# EAGLE design LCD_sterowanie (EAGLE 7.7.0)
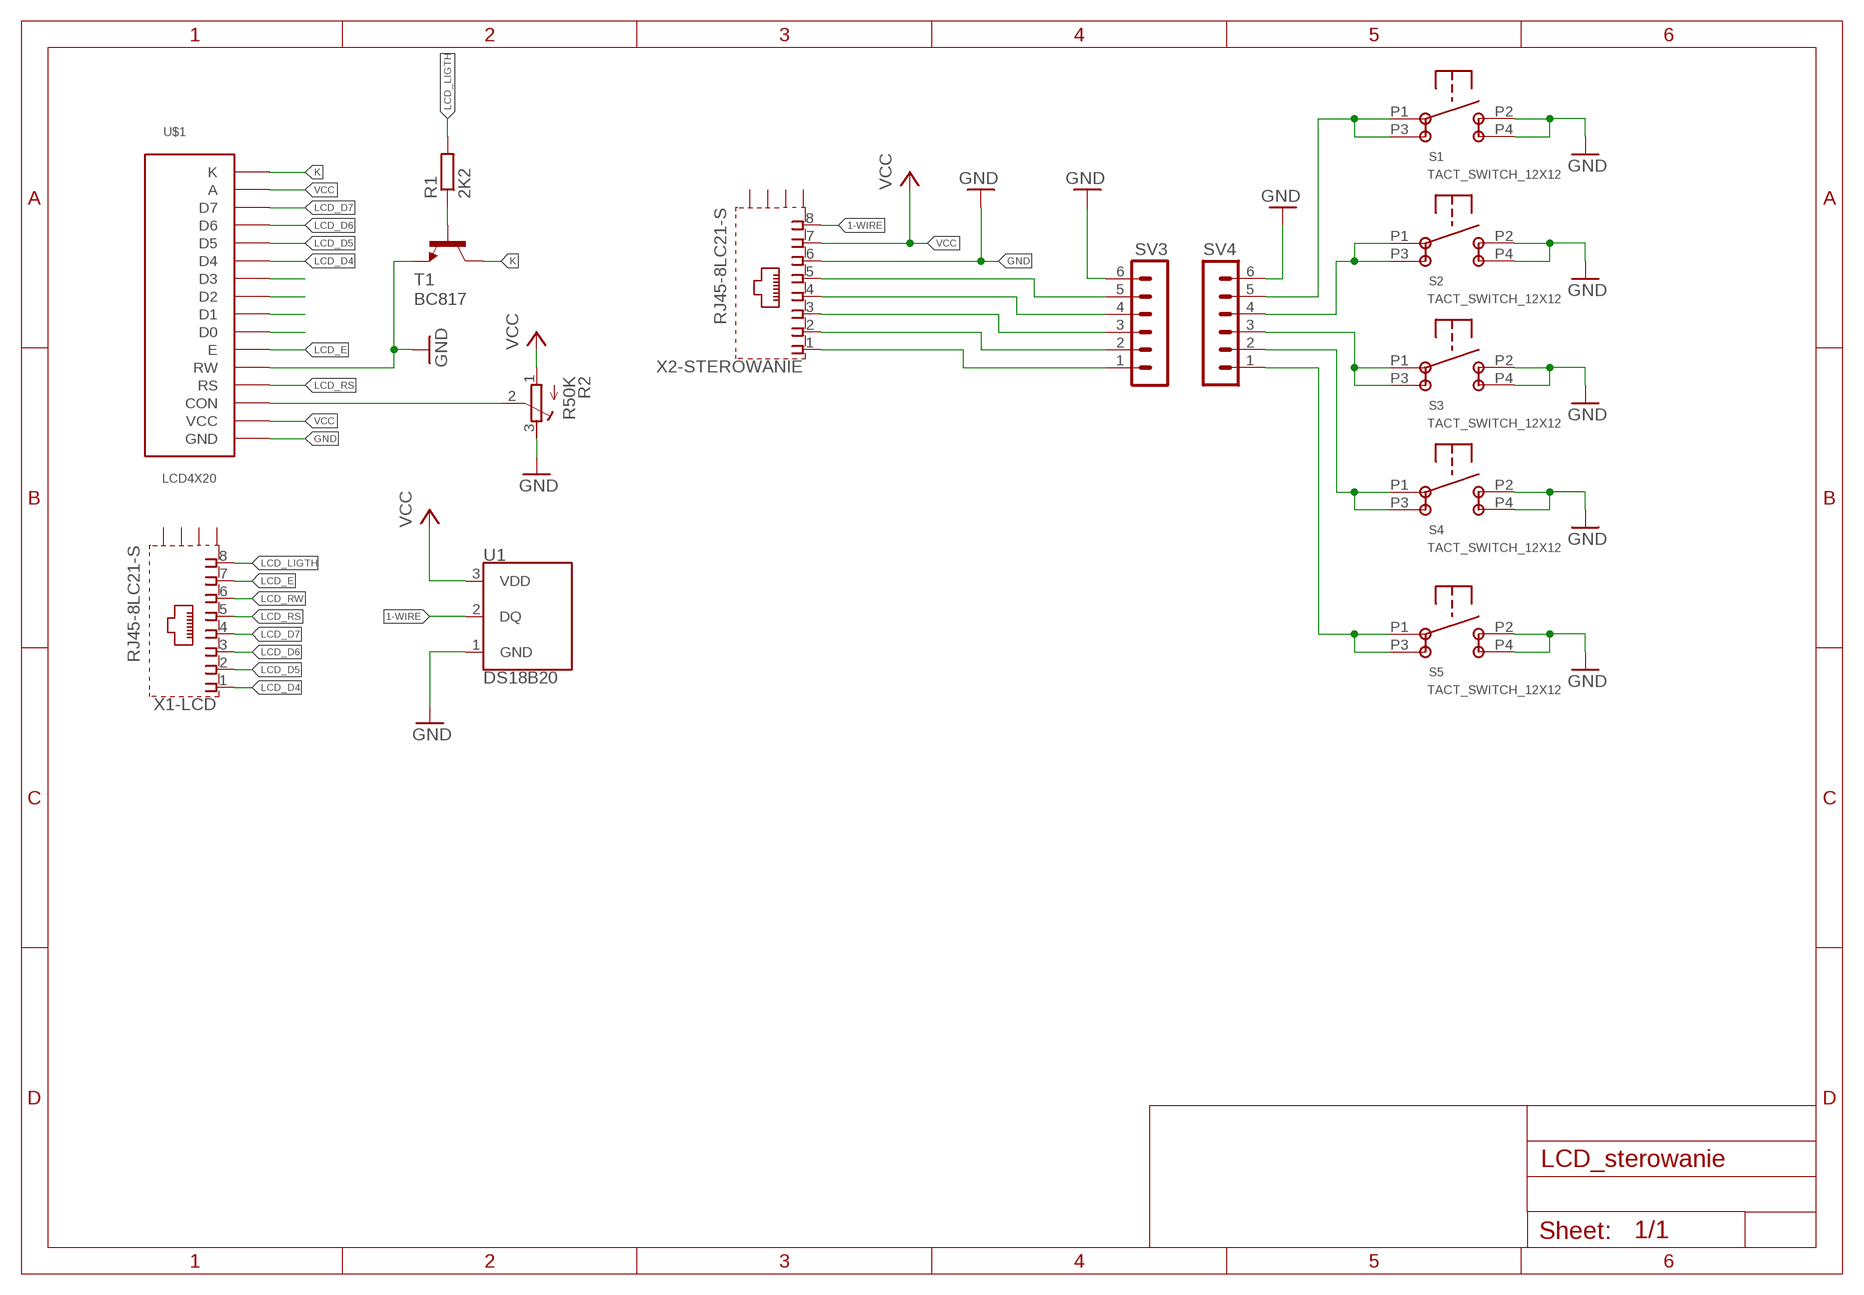
[diagram p0: schematic, sheet 1]

## Parts
R1  2K2  R-EU_M0805  [M0805]
R2  R50K  R-TRIMM3296P  [RTRIM3296P]
S1  TACT_SWITCH_12X12  [TACT_SWITCH_12X12]
S2  TACT_SWITCH_12X12  [TACT_SWITCH_12X12]
S3  TACT_SWITCH_12X12  [TACT_SWITCH_12X12]
S4  TACT_SWITCH_12X12  [TACT_SWITCH_12X12]
S5  TACT_SWITCH_12X12  [TACT_SWITCH_12X12]
SV3  MA06-1  [MA06-1]
SV4  MA06-1  [MA06-1]
T1  BC817  BC847  [SOT23]
U1  DS18B20  [TO-92-AMMO]
U$1  LCD4X20  [LCD4X20]
X1-LCD  RJ45-8LC21-S  [RJ45-SHIELD1]
X2-STEROWANIE  RJ45-8LC21-S  [RJ45-SHIELD1]

## Nets
1-WIRE: U1.2(DQ) X2-STEROWANIE.8
GND: R2.3(E) S1.P2 S1.P4 S2.P2 S2.P4 S3.P2 S3.P4 S4.P2 S4.P4 S5.P2 S5.P4 SV3.6 SV4.6 T1.2(E) U1.1(GND) U$1.GND U$1.RW X2-STEROWANIE.6
K: T1.3(C) U$1.K
LCD_D4: U$1.D4 X1-LCD.1
LCD_D5: U$1.D5 X1-LCD.2
LCD_D6: U$1.D6 X1-LCD.3
LCD_D7: U$1.D7 X1-LCD.4
LCD_E: U$1.E X1-LCD.7
LCD_LIGTH: R1.2 X1-LCD.8
LCD_RS: U$1.RS X1-LCD.5
LCD_RW: X1-LCD.6
N$1: R1.1 T1.1(B)
N$2: S1.P1 S1.P3 SV4.5
N$3: S2.P1 S2.P3 SV4.4
N$4: S3.P1 S3.P3 SV4.3
N$5: S4.P1 S4.P3 SV4.2
N$6: S5.P1 S5.P3 SV4.1
N$7: U$1.D3
N$8: U$1.D2
N$9: U$1.D1
N$10: U$1.D0
N$14: R2.2(S) U$1.CON
S1: SV3.1 X2-STEROWANIE.1
S2: SV3.2 X2-STEROWANIE.2
S3: SV3.3 X2-STEROWANIE.3
S4: SV3.4 X2-STEROWANIE.4
S5: SV3.5 X2-STEROWANIE.5
VCC: R2.1(A) U1.3(VDD) U$1.A U$1.VCC X2-STEROWANIE.7
Unconnected: X1-LCD.S1(S) X1-LCD.S2(S) X1-LCD.S3(S) X1-LCD.S4(S) X2-STEROWANIE.S1(S) X2-STEROWANIE.S2(S) X2-STEROWANIE.S3(S) X2-STEROWANIE.S4(S)

## Library data of the parts
R1 = resistor:R-EU_: RESISTOR, European symbol
R2 = resistor:R-TRIMM: Trimm resistor
S1-S5 = wachcio:TACT_SWITCH_12X12
SV3 SV4 = con-lstb:MA06-1: PIN HEADER; OC_FARNELL: unknown; OC_NEWARK: unknown
T1 = transistor:BC847: NPN TRANSISTOR
U1 = SparkFun-Sensors:DS18B20: Dallas/Maxim DS18B20 1-Wire Temperature Sensor The DS18B20 reports degrees C with 9 to 12-bit precision, -55C to 125C (+/-0.5C). Each sensor has a unique 64-Bit Serial number etched into it - allows for a huge number of sensors to be used on one data bus. Datasheet <http://datasheets.maximintegrated.com/en/ds/DS18B20.pdf> SparkFun Products One Wire Digital Temperature Sensor - DS18B20 <https://www.sparkfun.com/products/245> (SEN-00245); STORE_ID: SEN-00245
U$1 = wachcio:LCD4X20
X1-LCD X2-STEROWANIE = con-tycoelectronics:RJ45*2: RJ45 Low Profile Shield Type 2 For all RJ45 L, LC, LCT and X Series Models Source: www.tycoelectronics.com .. ENG_DS_1654001_1099_RJ_L_0507.pdf; OC_FARNELL: unknown; OC_NEWARK: unknown

## Board
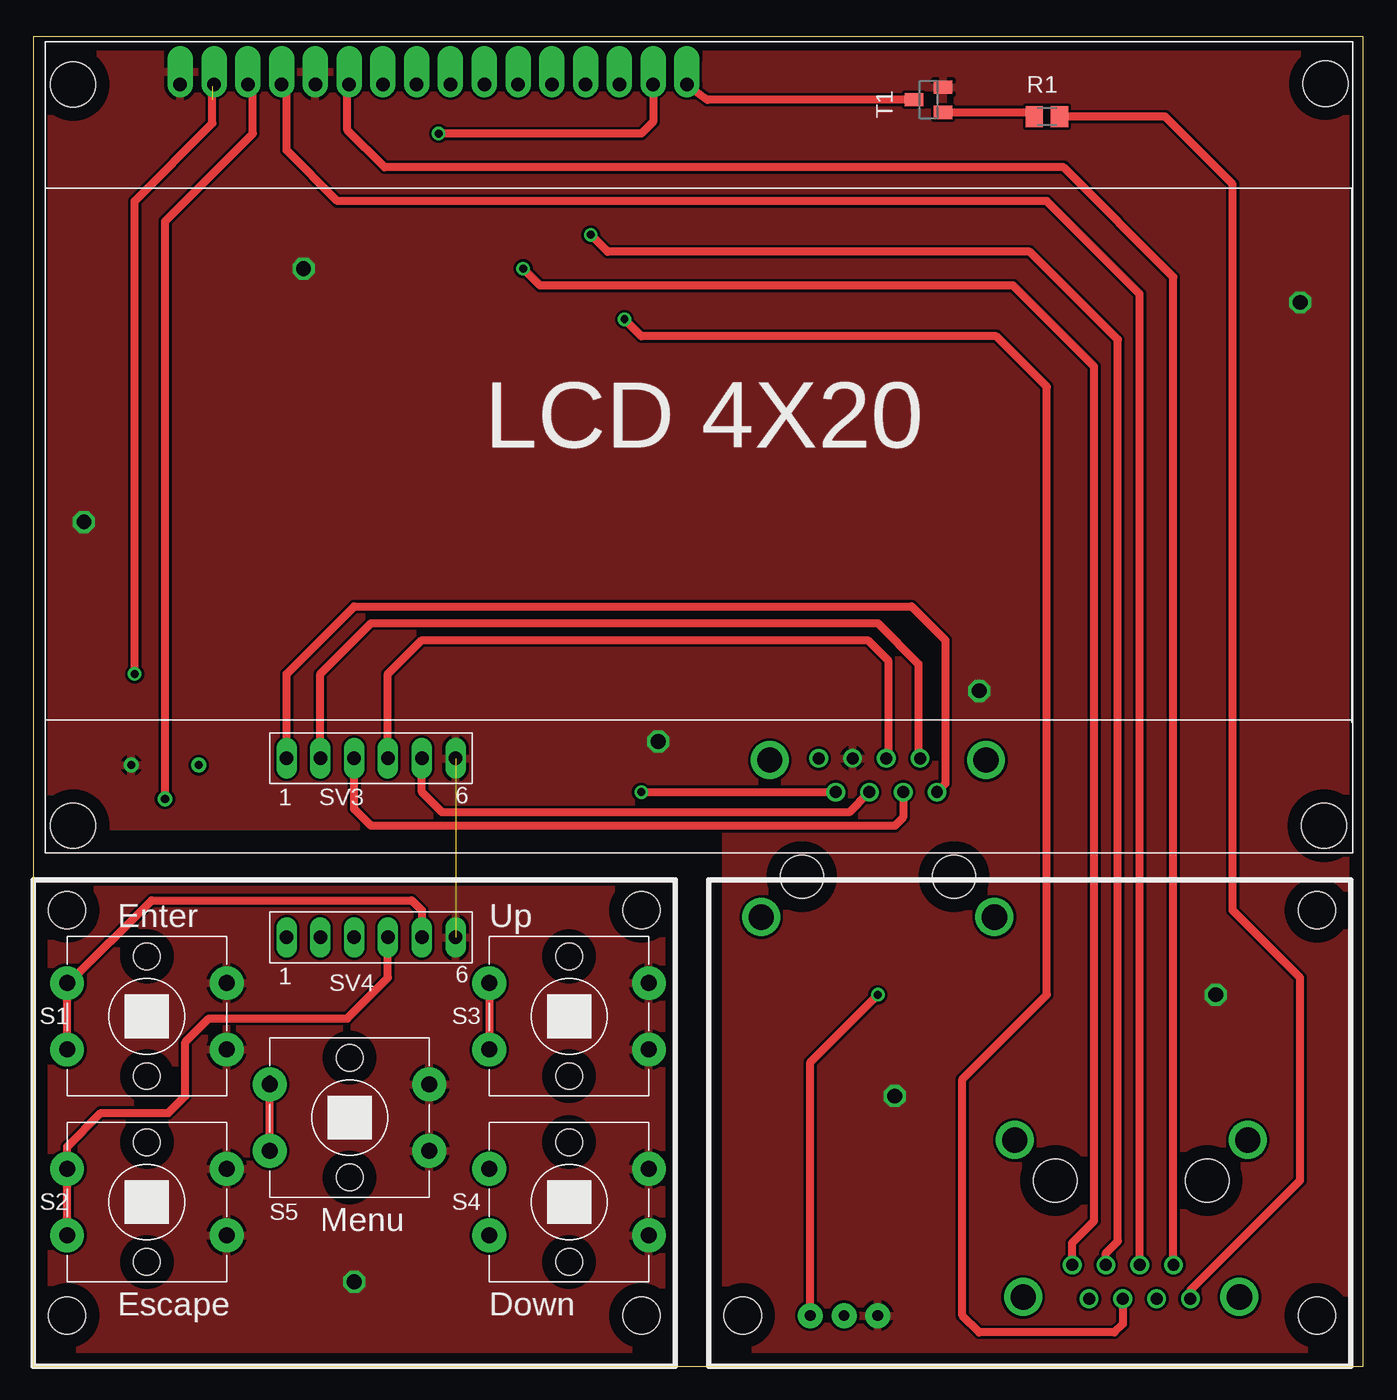
[diagram p1: board, top side]
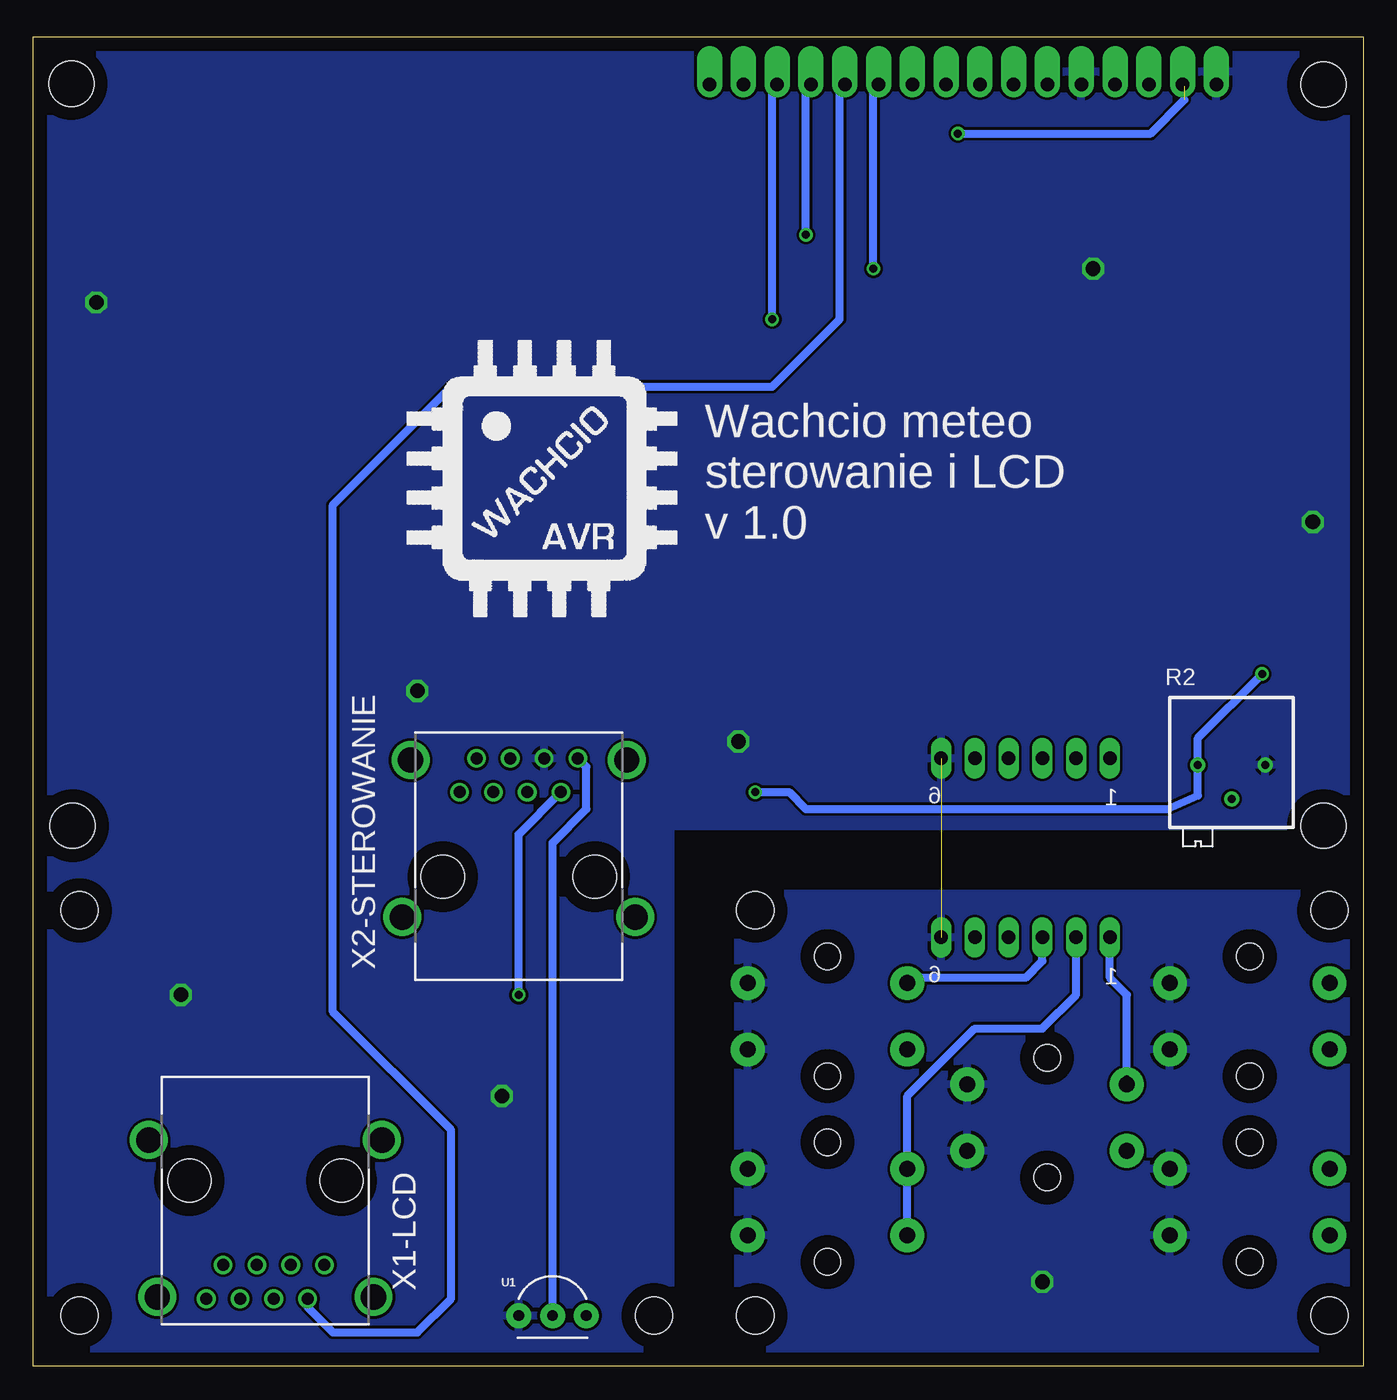
[diagram p2: board, bottom side, seen from below]

Size 100 x 100 mm. Coordinates in mm from the lower left corner, seen from the top.
Outline: 0,0 100,0 100,100 0,100 0,0
Copper layers (1*16): Top 0.035mm / dielectric 1.5mm / Bottom 0.035mm
Design rules "default": minimum track width 10mil, minimum drill 24mil, track to track 8mil, track to pad 8mil, pad to pad 8mil, via to via 8mil, smd to smd 8mil, copper to edge 40mil, drill to drill 8mil, minimum pad ring 10mil, minimum via ring 8mil, stop-mask expansion 4mil, vias tented up to drill 0mil, thermal gap 10mil
Holes 2.8 mm at 2.54,34.29 45.72,34.29 45.72,3.81 2.54,3.81 96.52,34.29 96.52,3.81 53.34,3.81

### Footprints (pad centres in the part's own frame; a part is rotated, then mirrored left to right if it is on the bottom)
M0805 = smd 1.3 x 1.6: 1 -0.95,0; 2 0.95,0
RTRIM3296P = drill 0.61: 1 0,-2.54; 2 2.54,0; 3 0,2.54
TACT_SWITCH_12X12 = drill 1.2 pad 2.54: P1 -6.35,2.15; P2 5.65,2.15; P3 -6.35,-2.85; P4 5.65,-2.85 | hole 2: -0.35,4.15; -0.35,-4.85
MA06-1 = drill 1.016 long: 1 -6.35,0; 2 -3.81,0; 3 -1.27,0; 4 1.27,0; 5 3.81,0; 6 6.35,0
SOT23 = smd 1 x 1.4: 1 -0.95,-1.1; 2 0.95,-1.1; 3 0,1.1
TO-92-AMMO = drill 0.813 pad 1.88: 1 -2.54,0; 2 0,0; 3 2.54,0
LCD4X20 = drill 1.016 pad 1.93 offset: A -1.27,32.385; CON -31.75,32.385; D0 -21.59,32.385; D1 -19.05,32.385; D2 -16.51,32.385; D3 -13.97,32.385; D4 -11.43,32.385; D5 -8.89,32.385; D6 -6.35,32.385; D7 -3.81,32.385; E -24.13,32.385; GND -36.83,32.385; K 1.27,32.385; RS -29.21,32.385; RW -26.67,32.385; VCC -34.29,32.385 | hole 3.4: -44.89,32.4; 49.26,32.45; 49.16,-23.35; -44.89,-23.35
RJ45-SHIELD1 = drill 0.9 pad 1.4: 1 -4.445,6.35; 2 -3.175,8.89; 3 -1.905,6.35; 4 -0.635,8.89; 5 0.635,6.35; 6 1.905,8.89; 7 3.175,6.35; 8 4.445,8.89 | drill 1.9 pad 2.5: S1 -8.763,-3.048; S2 8.763,-3.048; S3 -8.128,8.76; S4 8.128,8.76 | hole 3.251: -5.715,0; 5.715,0

### Placement (x,y rotation side)
R1  76.2,93.98 0 top
R2  9.91,45.21 270 bottom
S1  8.89,26.67 0 top
S2  8.89,12.7 0 top
S3  40.64,26.67 0 top
S4  40.64,12.7 0 top
S5  24.13,19.05 0 top
SV3  25.4,45.72 0 top
SV4  25.4,32.26 0 top
T1  67.31,95.25 90 top
U1  60.96,3.81 0 bottom
U$1  47.88,64.01 0 top
U$2  [LOGO]  59.69,66.04 0 bottom
X1-LCD  82.55,13.97 180 bottom
X2-STEROWANIE  63.5,36.83 0 bottom

### Tracks (layer width: path | path; a pad name or v marks a point on that pad's centre or on a via)
1-WIRE
  Bottom 0.61: U1.2 60.96,39.37 58.42,41.91 58.42,45.09 X2-STEROWANIE.8
GND  (via drill 1.1)  (1 unrouted)
  other vias: 20.32,82.55 3.81,63.5 71.12,50.8 95.25,80.01 88.9,27.94 64.77,20.32 24.13,6.35 46.99,46.99
  pour Bottom: 1.27,99.06 99.06,99.06 99.06,1.27 52.07,1.27 52.07,40.64 1.27,40.64
  pour Top: 1.27,99.06 1.27,40.64 52.07,40.64 52.07,1.27 99.06,1.27 99.06,99.06
  pour Top: 1.27,35.56 1.27,1.27 47.24,1.27 47.24,35.81 1.27,35.81
  pour Bottom: 1.27,35.56 1.27,1.27 46.99,1.27 46.99,35.56
K
  Top 0.61: T1.3 50.67,95.25 U$1.K
LCD_D4  (via drill 0.6)
  Top 0.61: X1-LCD.1 78.11,9.27 79.76,10.92 79.76,75.18 73.66,81.28 38.1,81.28 v36.83,82.55
  Bottom 0.61: v36.83,82.55 36.83,96.01 U$1.D4
LCD_D5
  Bottom 0.61: X1-LCD.2 79.38,4.45 77.47,2.54 71.12,2.54 68.58,5.08 68.58,17.78 77.47,26.67 77.47,64.77 68.58,73.66 44.45,73.66 39.37,78.74 39.37,96.01 U$1.D5
LCD_D6  (via drill 0.6)
  Top 0.61: v41.91,85.09 43.18,83.82 74.93,83.82 81.53,77.22 81.53,9.4 80.64,8.51 X1-LCD.3
  Bottom 0.61: v41.91,85.09 41.91,96.01 U$1.D6
LCD_D7  (via drill 0.6)
  Top 0.61: X1-LCD.4 81.92,3.17 81.28,2.54 71.12,2.54 69.85,3.81 69.85,21.59 76.2,27.94 76.2,73.66 72.39,77.47 45.72,77.47 v44.45,78.74
  Bottom 0.61: v44.45,78.74 44.45,96.01 U$1.D7
LCD_E
  Top 0.61: X1-LCD.7 85.72,81.92 77.47,90.17 26.42,90.17 23.62,92.96 23.62,96.27 U$1.E
LCD_LIGTH
  Top 0.61: X1-LCD.8 87,5.71 95.25,13.97 95.25,29.21 90.17,34.29 90.17,88.9 85.09,93.98 R1.2
LCD_RS
  Top 0.61: X1-LCD.5 83.19,80.64 76.2,87.63 22.86,87.63 19.05,91.44 19.05,96.01 U$1.RS
N$1
  Top 0.61: T1.1 74.93,94.3 R1.1
N$2
  Top 0.61: S1.P3 S1.P1 2.66,28.82 8.89,35.05 28.45,35.05 29.21,34.29 SV4.5
N$3
  Top 0.61: S2.P1 S2.P3 2.54,16.51 5.08,19.05 10.16,19.05 11.43,20.32 11.43,24.38 13.21,26.16 23.62,26.16 26.67,29.21 SV4.4
N$4
  Top 0.61: S3.P1 S3.P3
  Bottom 0.61: S3.P1 33.9,29.21 25.4,29.21 24.13,30.48 SV4.3
N$5
  Bottom 0.61: S4.P3 S4.P1 34.29,20.32 29.21,25.4 24.13,25.4 21.59,27.94 SV4.2
N$6  (via drill 0.6)
  Top 0.61: S5.P3 S5.P1 v17.78,21.59
  Bottom 0.61: v17.78,21.59 17.78,27.94 19.05,29.21 SV4.1
N$14
  Top 0.61: U$1.CON 16.51,96.01 16.51,92.71 9.91,86.11 R2.2
S1
  Top 0.61: SV3.1 19.05,52.07 24.13,57.15 66.04,57.15 68.58,54.61 68.58,43.81 X2-STEROWANIE.1
S2
  Top 0.61: SV3.2 21.59,52.07 25.4,55.88 63.5,55.88 66.55,52.83 66.55,45.85 X2-STEROWANIE.2
S3
  Top 0.61: X2-STEROWANIE.3 65.41,41.27 64.77,40.64 25.4,40.64 24.13,41.91 SV3.3
S4
  Top 0.61: SV3.4 26.67,52.07 29.21,54.61 62.74,54.61 64.26,53.09 64.26,45.85 X2-STEROWANIE.4
S5
  Top 0.61: X2-STEROWANIE.5 61.34,41.66 30.73,41.66 29.21,43.18 SV3.5
VCC  (via drill 0.6)  (1 unrouted)
  Top 0.61: U1.3 58.42,22.86 v63.5,27.94 | U$1.VCC 13.46,96.27 13.46,93.47 7.62,87.63 v7.62,52.07 | U$1.A 46.61,93.6 45.72,92.71 v30.48,92.71 | v45.72,43.18 X2-STEROWANIE.7
  Bottom 0.61: v63.5,27.94 63.5,40.01 X2-STEROWANIE.7 | v30.48,92.71 16,92.71 13.46,95.25 | v7.62,52.07 12.45,47.24 R2.1 12.45,42.93 14.73,41.91 41.91,41.91 43.18,43.18 v45.72,43.18

### Text on the board
bPlace: Wachcio meteo / sterowanie i LCD / v 1.0
tNames: Enter | Up | Menu | Escape | Down